# EasyEDA Pro project ProDoc_Board_ESP_AI_2024-12-05.epro, schematic Sche_ESP_AI

## Sheets
1 Power: Board Name: Board_ESP_AI; Create Date: 2024-12-01; Page Name: Power; Project Name: ESP-AI-1.0.2; Schematic Name: Sche_ESP_AI; Update Date: 2024-12-01; Company: 嘉立创EDA; Page Size: A4; Version: V1.0
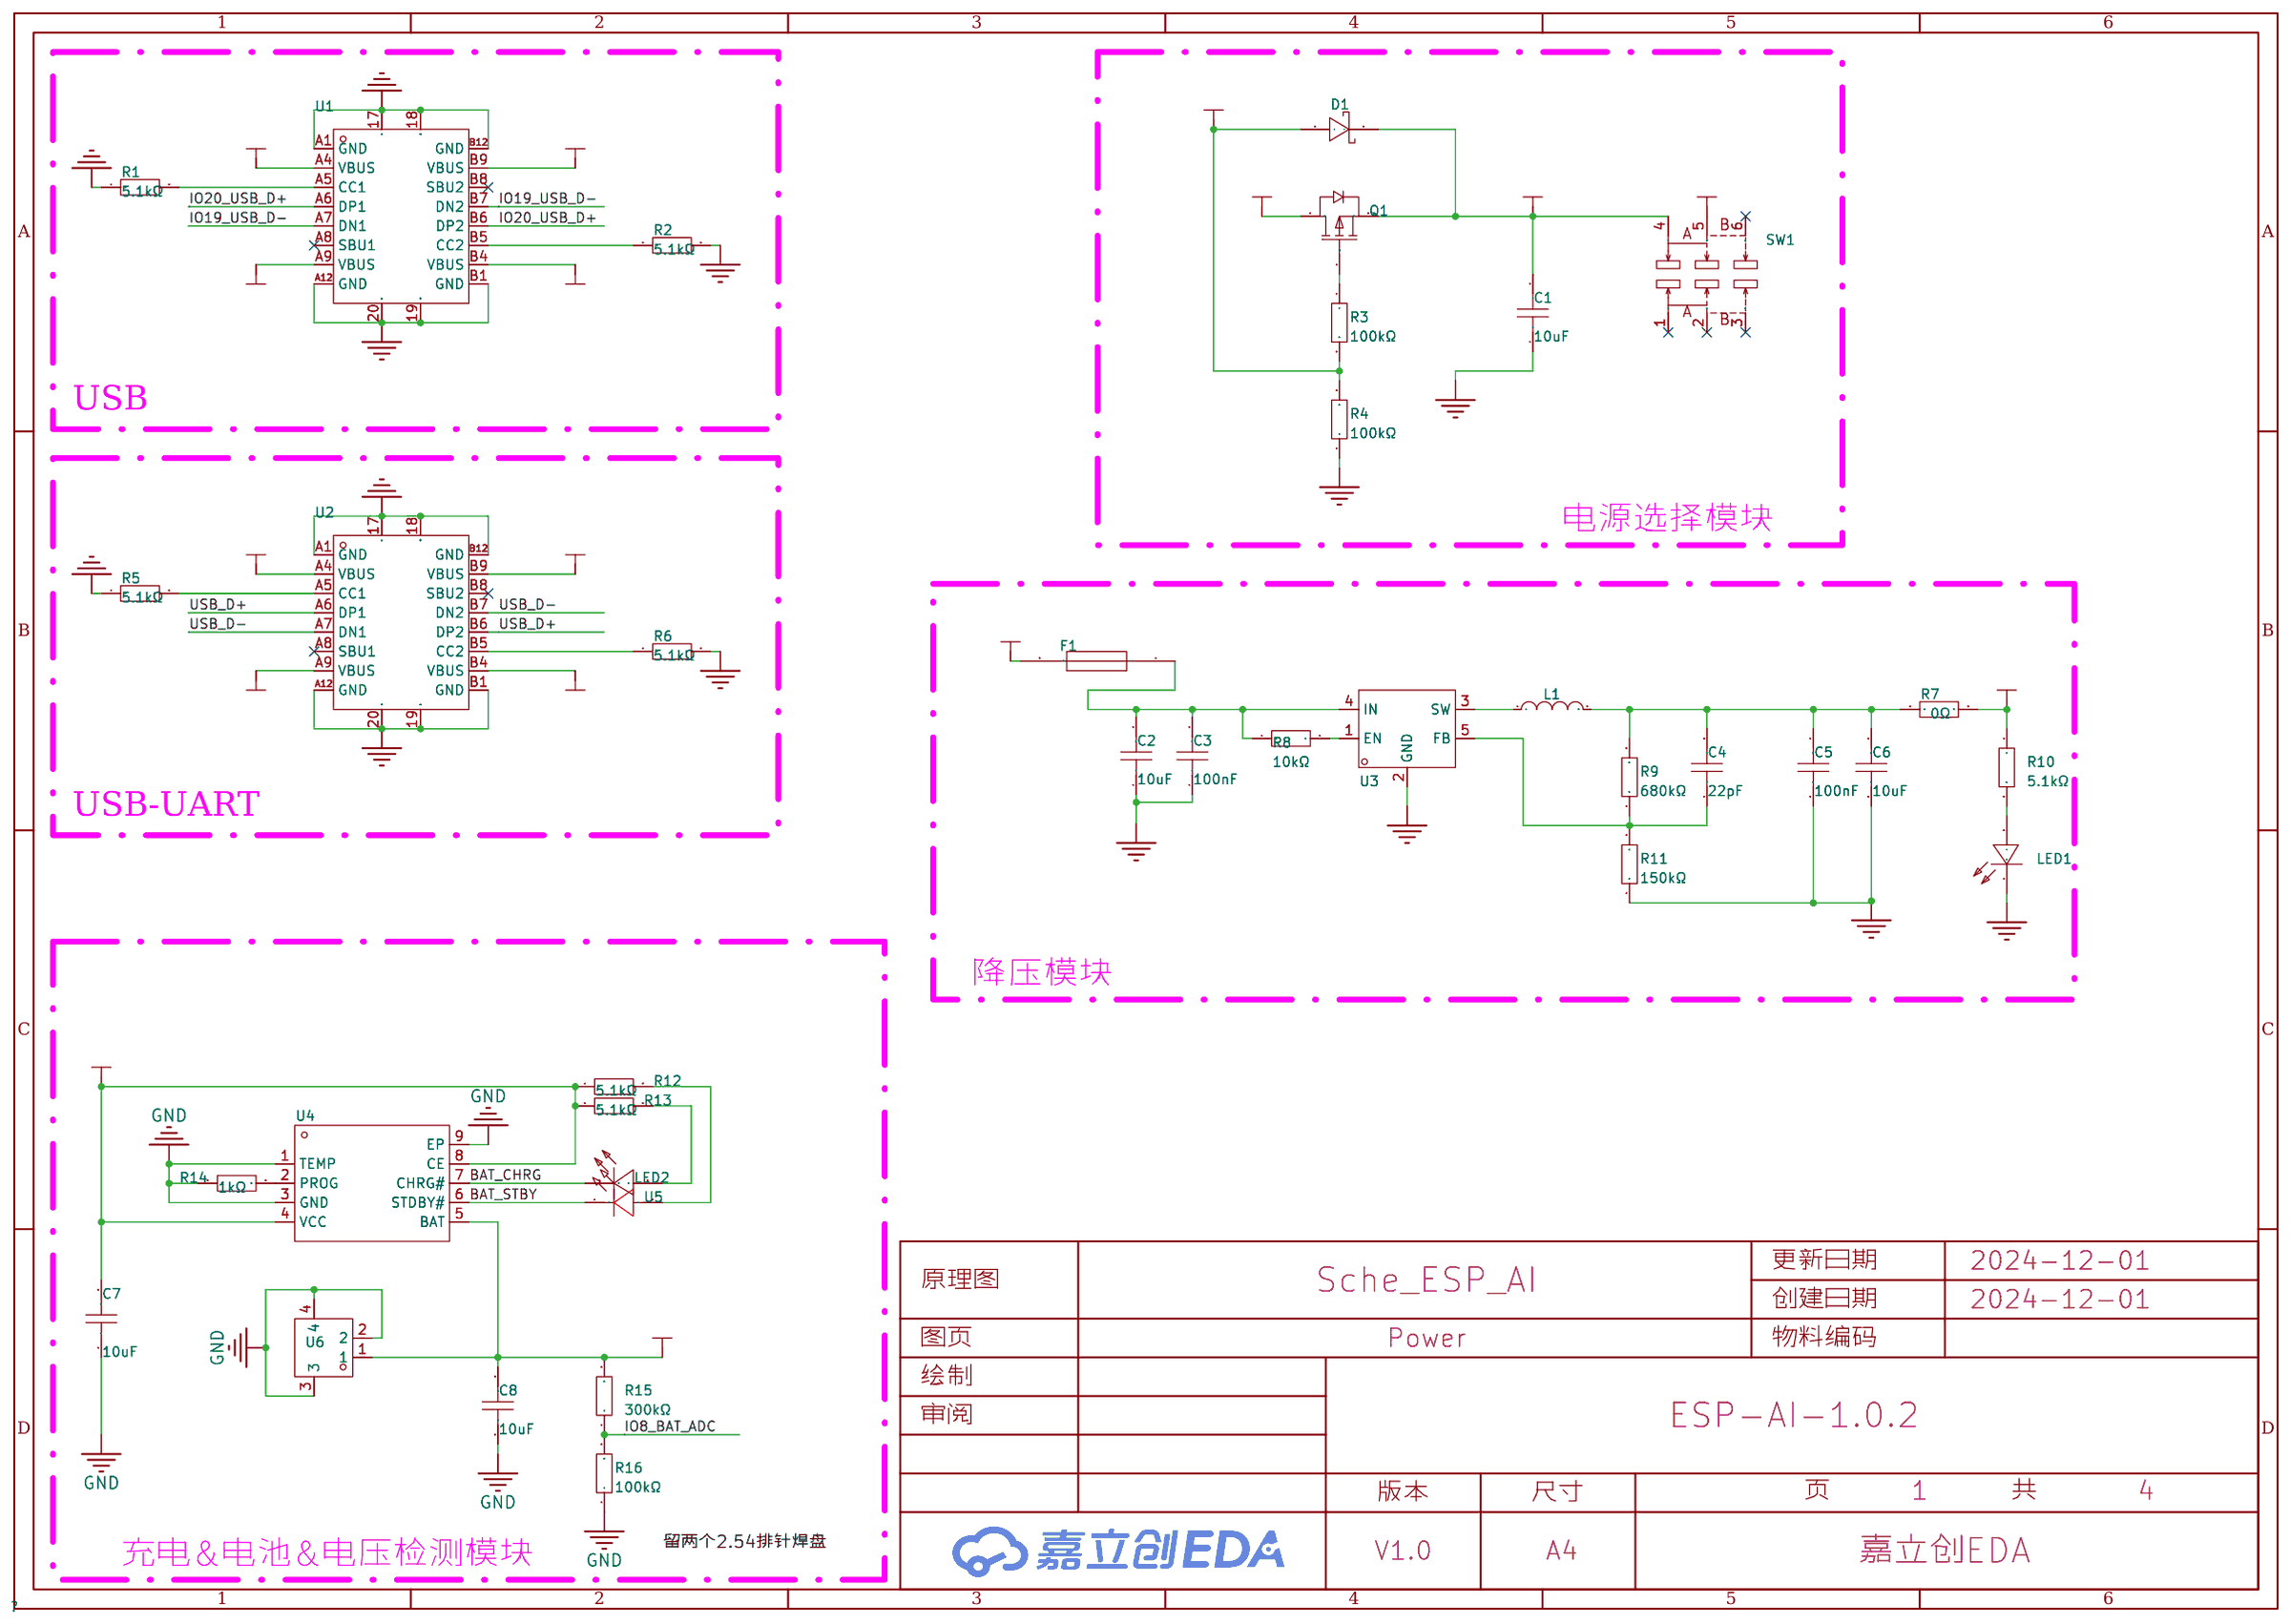
[diagram p0: Power]
2 Mcu: Page Name: Mcu
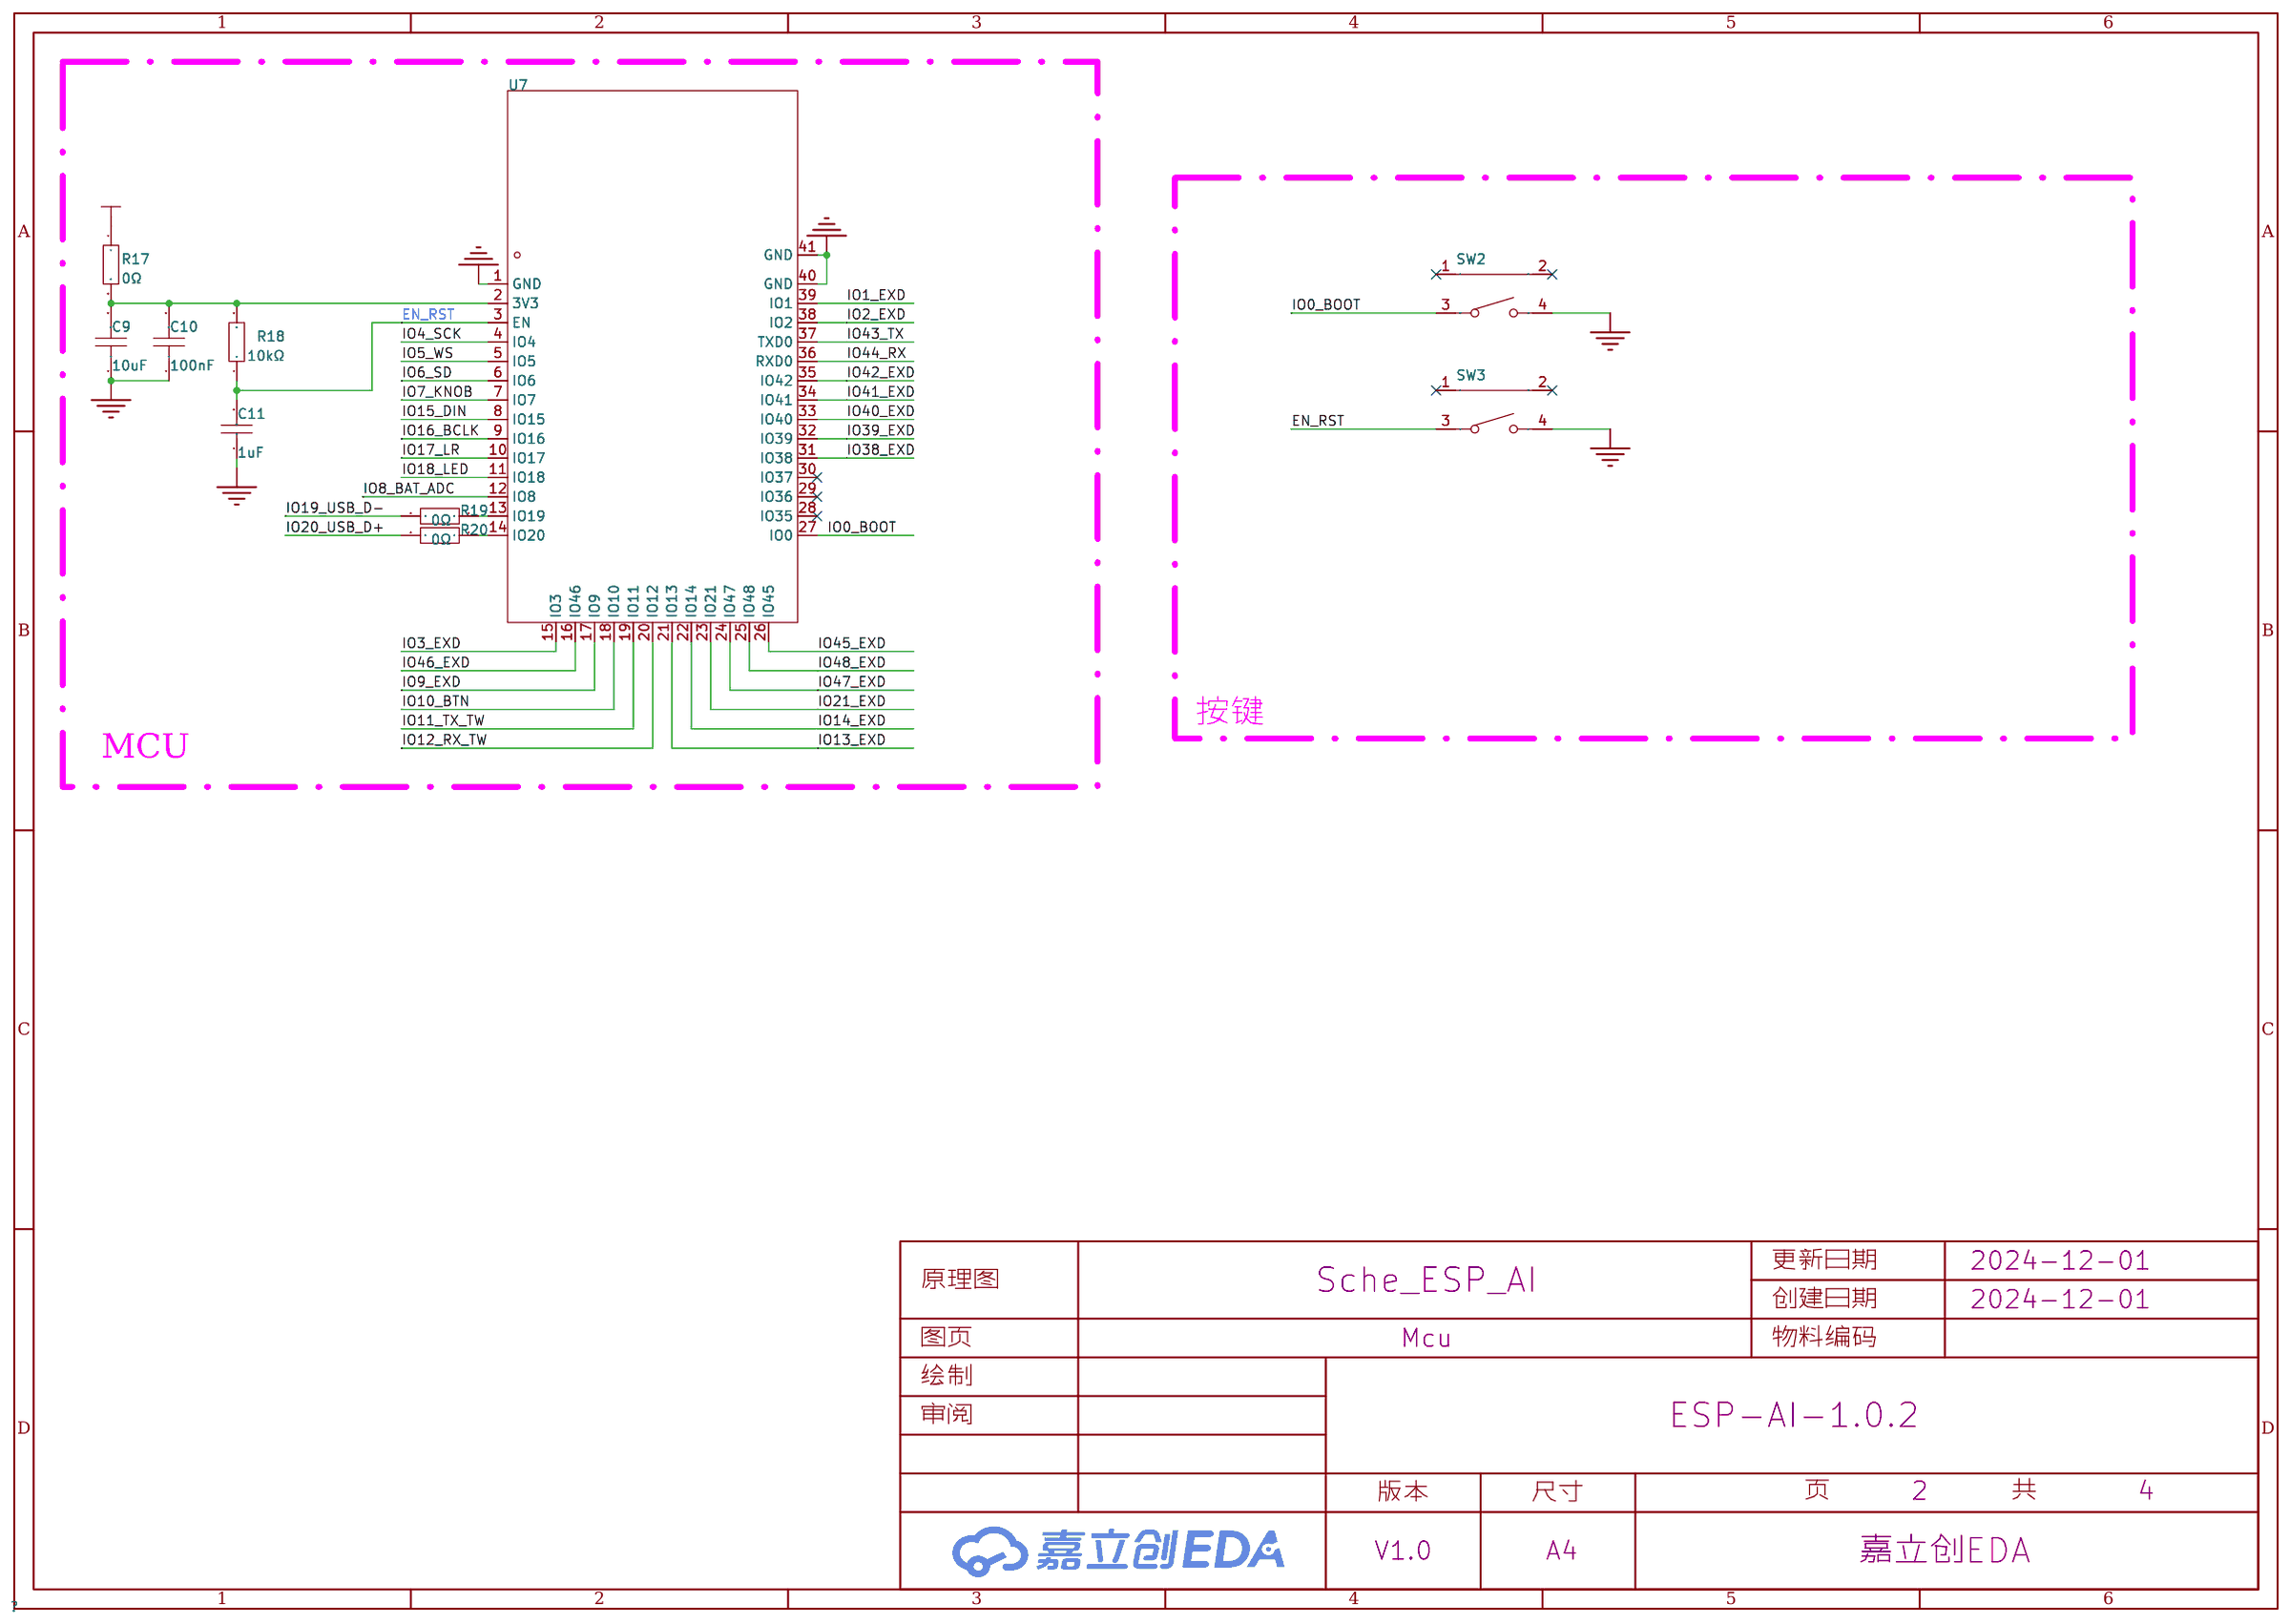
[diagram p1: Mcu]
3 Module: Page Name: Module
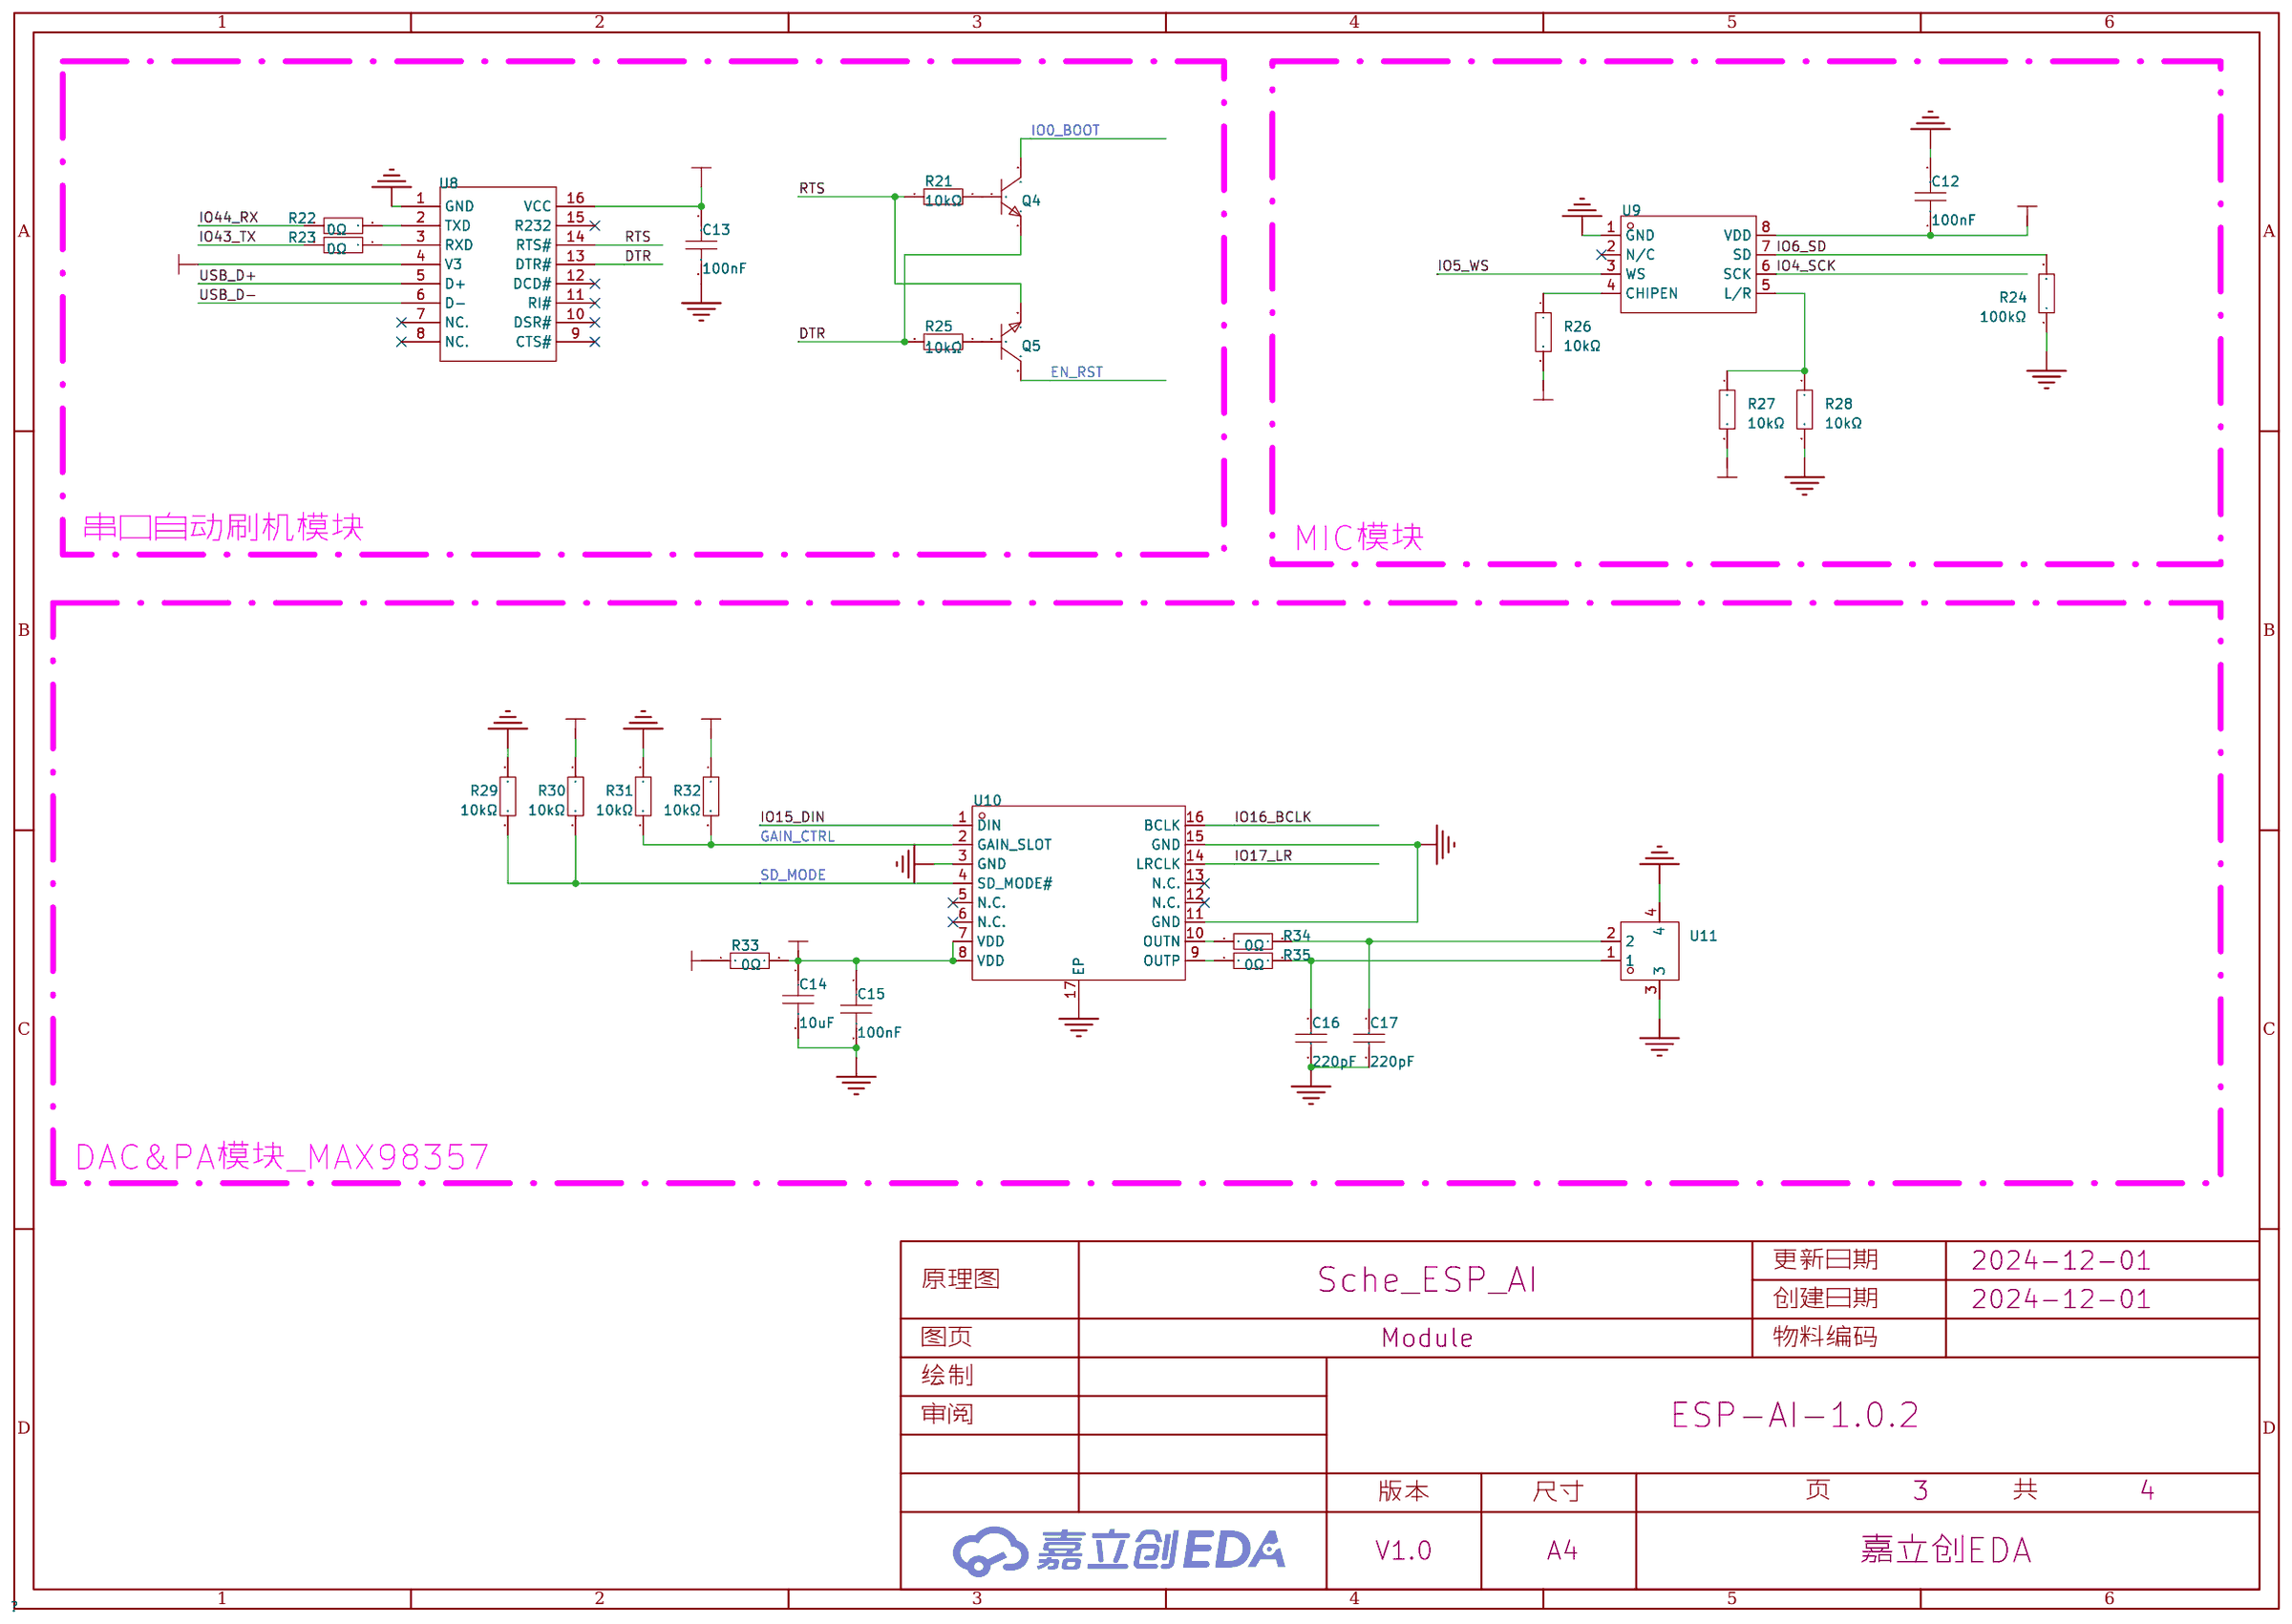
[diagram p2: Module]
4 Interface: Page Name: Interface
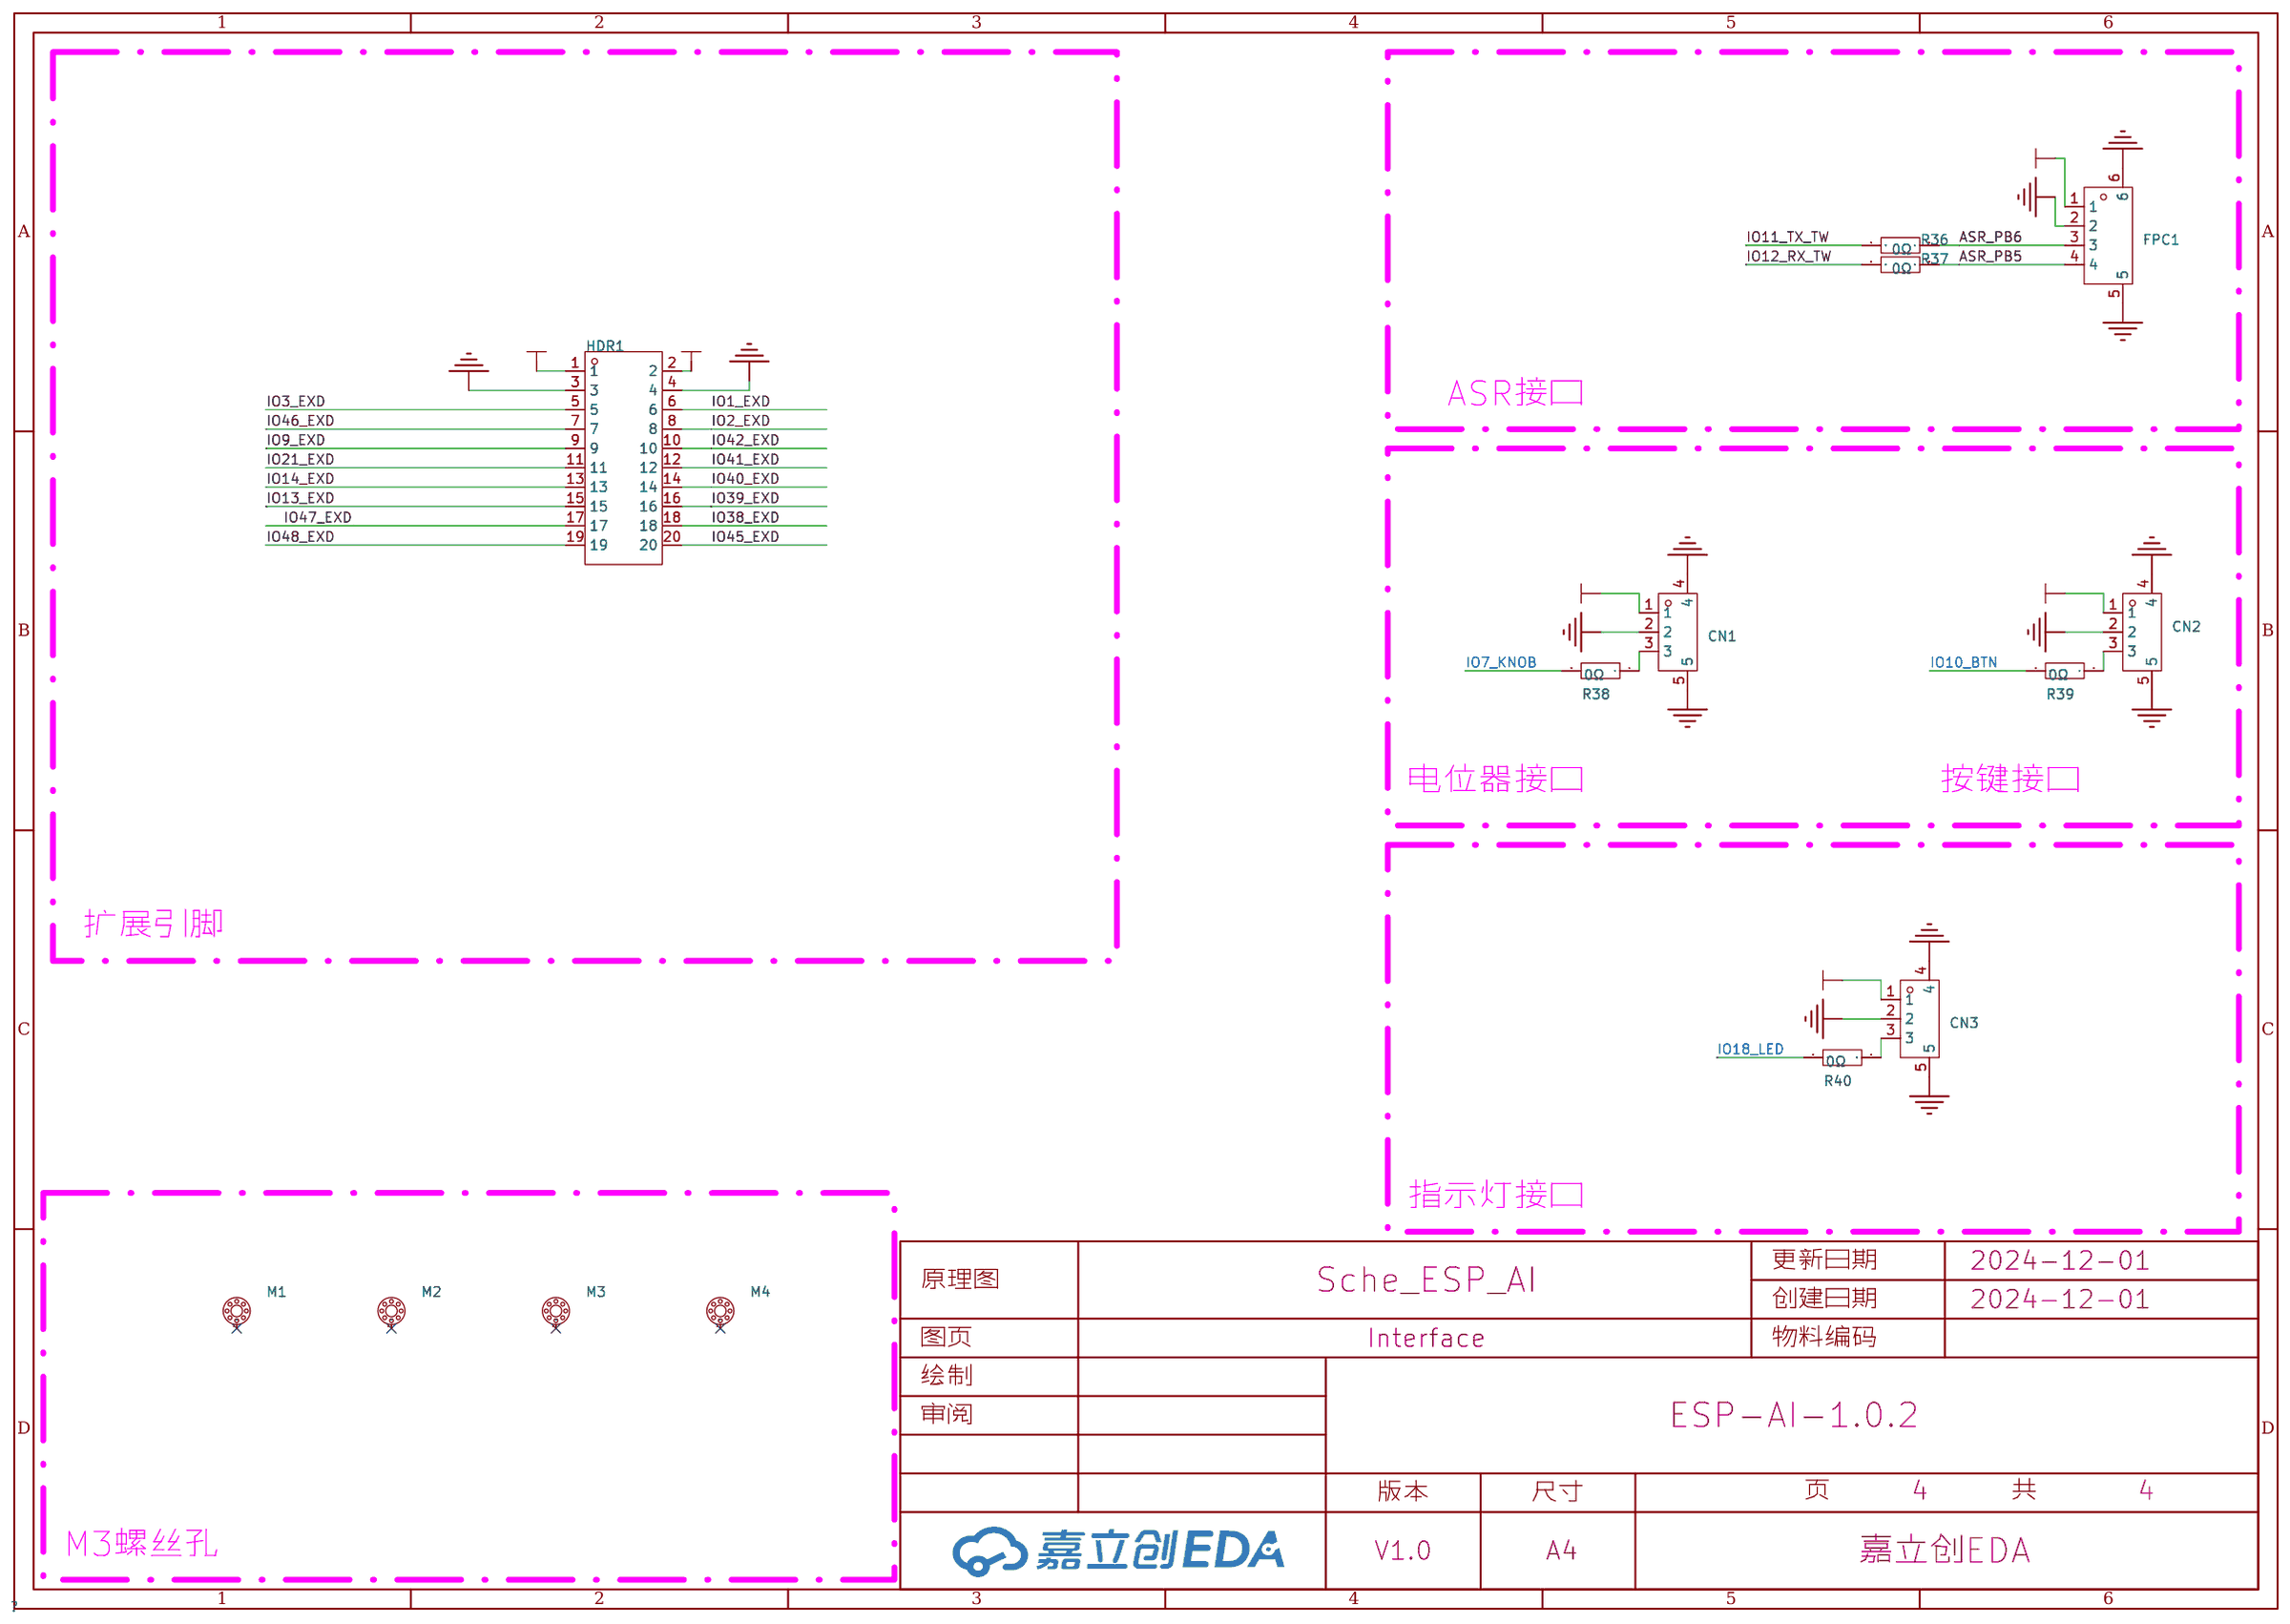
[diagram p3: Interface]

## Parts
sheet Interface
CN1  HC-1.25-3PWT  [CONN-SMD_HC-1.25-3PWT]
CN2  HC-1.25-3PWT  [CONN-SMD_HC-1.25-3PWT]
CN3  HC-1.25-3PWT  [CONN-SMD_HC-1.25-3PWT]
FPC1  1.25-4PWB  [CONN-SMD_1.25-4PWB]
HDR1  PZ254-2-10-S  [HDR-SMD_20P-P2.54-V-M-R2-C10-S7.4]
M1  -  [M3*5安装孔]
M2  -  [M3*5安装孔]
M3  -  [M3*5安装孔]
M4  -  [M3*5安装孔]
R36  0Ω  [R0603_1]
R37  0Ω  [R0603_1]
R38  0Ω  [R0603_1]
R39  0Ω  [R0603_1]
R40  0Ω  [R0603_1]
sheet Mcu
C9  10uF  [C0603]
C10  100nF  [C0603]
C11  1uF  [C0603_1]
R17  0Ω  [R0603_1]
R18  10kΩ  [R0603_1]
R19  0Ω  [R0603_1]
R20  0Ω  [R0603_1]
SW2  TS24CA  [SW-SMD_TS24CA]
SW3  TS24CA  [SW-SMD_TS24CA]
U7  ESP32-S3-WROOM-1-N16R8  [WIRELM-SMD_ESP32-S3-WROOM-1]
sheet Module
C12  100nF  [C0603]
C13  100nF  [C0603_1]
C14  10uF  [C0603]
C15  100nF  [C0603]
C16  220pF  [C0603_1]
C17  220pF  [C0603_1]
Q4  SS8050  [SOT-23-3_L2.9-W1.3-P1.90-LS2.4-BR]
Q5  SS8050  [SOT-23-3_L2.9-W1.3-P1.90-LS2.4-BR]
R21  10kΩ  [R0603_1]
R22  0Ω  [R0603_1]
R23  0Ω  [R0603_1]
R24  100kΩ  [R0603]
R25  10kΩ  [R0603_1]
R26  10kΩ  [R0603_1]
R27  10kΩ  [R0603_1]  (no BOM)
R28  10kΩ  [R0603_1]
R29  10kΩ  [R0603_1]  (no BOM)
R30  10kΩ  [R0603_1]
R31  10kΩ  [R0603_1]
R32  10kΩ  [R0603_1]
R33  0Ω  [R0603_1]
R34  0Ω  [R0603_1]
R35  0Ω  [R0603_1]
U8  CH340C  [SOP-16_L10.0-W3.9-P1.27-LS6.0-BL]
U9  MSM261S4030H0R  [MIC-SMD_8P-L4.0-W3.0-P1.00-BR]
U10  MAX98357AETE+T  [TQFN-16_L3.0-W3.0-P0.50-BL-EP1.5]
U11  HCZZ0015-2  [CONN-SMD_HCZZ0015-2]
sheet Power
C1  10uF  [C0603]
C2  10uF  [C0603]
C3  100nF  [C0603]
C4  22pF  [C0603_1]
C5  100nF  [C0603]
C6  10uF  [C0603]
C7  10uF  [C0603]
C8  10uF  [C0603]
D1  B5819W SL  [SOD-123_L2.7-W1.6-LS3.7-RD-1]
F1  JK-SMD0603-100L  [F0603]
L1  2.2uH  [IND-SMD_L4.0-W4.0]
LED1  KT-0603R  [LED0603-RD]
LED2  KT-0603R  [LED0603-RD]
Q1  AO3401A  [SOT-23_L2.9-W1.3-P1.90-LS2.4-BR]
R1  5.1kΩ  [R0603]
R2  5.1kΩ  [R0603]
R3  100kΩ  [R0603]
R4  100kΩ  [R0603]
R5  5.1kΩ  [R0603]
R6  5.1kΩ  [R0603]
R7  0Ω  [R0603_1]
R8  10kΩ  [R0603_1]
R9  680kΩ  [R0603_1]
R10  5.1kΩ  [R0603]
R11  150kΩ  [R0603_1]
R12  5.1kΩ  [R0603]
R13  5.1kΩ  [R0603]
R14  1kΩ  [R0603]
R15  300kΩ  [R0603]
R16  100kΩ  [R0603]
SW1  MST22D18G2 125  [SW-SMD_MST22D18G2]
U1  24018-UCAF001-A  [TYPE-C-USB-SMD_CF003]
U2  24018-UCAF001-A  [TYPE-C-USB-SMD_CF003]
U3  ETA3409S2F  [SOT-23-5_L2.9-W1.6-P0.95-LS2.8-BL]
U4  AP5056  [SOP-8_L4.9-W3.9-P1.27-LS6.0-BL-EP]
U5  19-217/GHC-YR1S2/6T  [LED0603-RD_GREEN]
U6  HCZZ0015-2  [CONN-SMD_HCZZ0015-2]

## Library data of the parts
CN1-CN3 = HC-1.25-3PWT: 插针结构:1x3P;间距:1.25mm;安装方式:卧贴;参考系列:PicoBlade(MX 1.25);总PIN数:3P;排数:1;每排PIN数:3;行距:-;额定电流:1A;触头材质:黄铜;触头镀层:锡;工作温度范围:-40℃~+105℃;; LCSC Part Name: 1x3P 间距:1.25mm 卧贴 系列:PicoBlade(MX 1.25); Supplier Part: C2845380; Manufacturer: HCTL(华灿天禄); Supplier Footprint: SMD,P=1.25mm,卧贴; JLCPCB Part Class: 扩展库; Datasheet: https://atta.szlcsc.com/upload/public/pdf/source/20240930/9508A8292CCC87B0C29E3A028D56E30A.pdf; Supplier: LCSC; Pins Structure: 1x3P; Pitch: 1.25mm; Mounting Style: 卧贴; Reference Series: PicoBlade(MX 1.25); Number of Pins: 3P; Number of Rows: 1; Number of PINs Per Row: 3; Current Rating (Max): 1A; Contact Material: 黄铜; Contact Plating: 锡; Operating Temperature Range: -40℃~+105℃; Rated Voltage (Max): 125V; Plastic Material: LCP; Flame Retardant Rating: UL94V-0; Supplementary Features: 辅助焊脚; Z-Height of the Board: 3.57mm; X-Length of Bottom Edge on Board (Spacing Line): 8.8mm; Y-Width of Bottom Edge on Board: 5.25mm
FPC1 = 1.25-4PWB: 插针结构:1x4P;间距:1.25mm;安装方式:卧贴;参考系列:-;总PIN数:4P;排数:1;每排PIN数:4;行距:-;额定电流:-;工作温度范围:-40℃~+85℃;; LCSC Part Name: 1x4P 间距:1.25mm 卧贴; Supplier Part: C2905011; Manufacturer: DEALON(德艺隆); Supplier Footprint: SMD,P=1.25mm,卧贴; JLCPCB Part Class: 扩展库; Datasheet: https://atta.szlcsc.com/upload/public/pdf/source/20231123/1AE0876AE9C7DCFC0D68EAC4CBA881B0.pdf; Supplier: LCSC; Pins Structure: 1x4P; Pitch: 1.25mm; Mounting Style: 卧贴; Number of Pins: 4P; Number of Rows: 1; Number of PINs Per Row: 4; Operating Temperature Range: -40℃~+85℃
HDR1 = PZ254-2-10-S: 插针结构:2x10P;间距:2.54mm;行距:2.54mm;圆针/方针:方针;安装类型:立贴;排数:双排;总PIN位数:20P;额定电流:3A;额定电压:250V;配合针长度:6mm;塑高:2.5mm;端接针长度:-;工作温度范围:-40℃~+105℃;焊接温度(最大值):260℃@5S;颜色:黑色;; LCSC Part Name: 2x10P 间距:2.54mm 方针 立贴 黑色; Supplier Part: C3294468; Manufacturer: HCTL(华灿天禄); Supplier Footprint: SMD,P=2.54mm; JLCPCB Part Class: 扩展库; Datasheet: https://atta.szlcsc.com/upload/public/pdf/source/20230609/FB2B5B924AA338E6CB93C3BD1D012B72.pdf; Supplier: LCSC; Pin Structure: 2x10P; Pitch: 2.54mm; Row Spacing: 2.54mm; Circluar Pins/Square Pins: 方针; Mounting Type: 立贴; Number of Rows: 双排; Number of Pins: 20P; Current Rating (Max): 3A; Voltage Rating (Max): 250V; Length of Mating Pin: 6mm; Insulation Height: 2.5mm; Operating Temperature Range: -40℃~+105℃; Soldering Temperature(Max): 260℃@5S; Color: 黑色
M1-M4 = M3螺丝
R17 R19 R20 R22 R23 R33-R40 = 0603WAF0000T5E: 电阻类型:厚膜电阻;阻值:0Ω;精度:±1%;功率:100mW;; LCSC Part Name: 0Ω ±1% 100mW; Supplier Part: C21189; Manufacturer: UNI-ROYAL(厚声); Supplier Footprint: 0603; JLCPCB Part Class: Basic Part; Datasheet: https://atta.szlcsc.com/upload/public/pdf/source/20200306/C422600_1E6D84923E4A46A82E41ADD87F860B5C.pdf; Supplier: LCSC; Type: 厚膜电阻; Tolerance: ±1%; Power(Watts): 100mW; Overload Voltage (Max): 75V; Operating Temperature Range: -55℃~+155℃
C1 C7-C9 = CL10A106KP8NNNC: 容值:10uF;精度:±10%;额定电压:10V;材质(温度系数):X5R;; LCSC Part Name: 10uF ±10% 10V; Supplier Part: C19702; Manufacturer: SAMSUNG(三星); Supplier Footprint: 0603; JLCPCB Part Class: Basic Part; Datasheet: https://atta.szlcsc.com/upload/public/pdf/source/20160103/1457707703378.pdf; Supplier: LCSC; Tolerance: ±10%; Voltage Rated: 10V; Temperature Coefficient: X5R
C10 C13 = CC0603KRX7R9BB104: 容值:100nF;精度:±10%;额定电压:50V;材质(温度系数):X7R;; LCSC Part Name: 100nF ±10% 50V; Supplier Part: C14663; Manufacturer: YAGEO(国巨); Supplier Footprint: 0603; JLCPCB Part Class: Basic Part; Datasheet: https://atta.szlcsc.com/upload/public/pdf/source/20170116/1484561234239.pdf; Supplier: LCSC; Tolerance: ±10%; Voltage Rated: 50V; Temperature Coefficient: X7R
C11 = CL10A105KB8NNNC: 容值:1uF;精度:±10%;额定电压:50V;材质(温度系数):X5R;; LCSC Part Name: 1uF ±10% 50V; Supplier Part: C15849; Manufacturer: SAMSUNG(三星); Supplier Footprint: 0603; JLCPCB Part Class: 基础库; Datasheet: https://atta.szlcsc.com/upload/public/pdf/source/20160103/1457707679084.pdf; Supplier: LCSC; Tolerance: ±10%; Voltage Rated: 50V; Temperature Coefficient: X5R
R18 R26-R32 = 0603WAF1002T5E: 电阻类型:厚膜电阻;阻值:10kΩ;精度:±1%;功率:100mW;; LCSC Part Name: 厚膜电阻 10kΩ ±1% 100mW; Supplier Part: C25804; Manufacturer: UNI-ROYAL(厚声); Supplier Footprint: 0603; JLCPCB Part Class: Basic Part; Datasheet: https://atta.szlcsc.com/upload/public/pdf/source/20200306/C422600_1E6D84923E4A46A82E41ADD87F860B5C.pdf; Supplier: LCSC; Type: 厚膜电阻; Tolerance: ±1%; Power(Watts): 100mW; Temperature Coefficient: ±100ppm/℃; Overload Voltage (Max): 75V; Operating Temperature Range: -55℃~+155℃
SW2 SW3 = TS24CA: 电路结构:单刀单掷;按钮形状:矩形按钮;安装方式:卧贴;开关长度:4.55mm;开关宽度:1.8mm;开关高度:3.5mm;触点电流:50mA;额定电压(DC):12V;带灯:-;机械寿命:-;; LCSC Part Name: 4.55*1.8*3.5mm 卧贴 轻触开关; Supplier Part: C393942; Manufacturer: SHOU HAN(首韩); Supplier Footprint: SMD; JLCPCB Part Class: 扩展库; Datasheet: https://atta.szlcsc.com/upload/public/pdf/source/20190521/C393942_591A9E318887EFA4274D34029981AD99.pdf; Supplier: LCSC; Circuit: 单刀单掷; Actuator Style: 矩形按钮; Mounting Style: 卧贴; Switch Length: 4.55mm; Switch Width: 1.8mm; Switch Height: 3.5mm; Contact Current: 50mA; Voltage Rating (DC): 12V
U7 = ESP32-S3-WROOM-1-N16R8: LCSC Part Name: 通用型Wi-Fi+低功耗蓝牙MCU模组; Supplier Part: C2913202; Manufacturer: ESPRESSIF(乐鑫); Supplier Footprint: SMD,18x25.5mm; JLCPCB Part Class: 扩展库; Datasheet: https://atta.szlcsc.com/upload/public/pdf/source/20220705/4E799F39581577F766659887F738A439.pdf; Supplier: LCSC
C12 C15 = CC0603KRX7R9BB104: 容值:100nF;精度:±10%;额定电压:50V;材质(温度系数):X7R;; LCSC Part Name: 100nF ±10% 50V; Supplier Part: C14663; Manufacturer: YAGEO(国巨); Supplier Footprint: 0603; JLCPCB Part Class: Basic Part; Datasheet: https://atta.szlcsc.com/upload/public/pdf/source/20180910/C282072_33301C7F631E79921B82A8DAC6BCC5B3.pdf; Supplier: LCSC; Tolerance: ±10%; Voltage Rated: 50V; Temperature Coefficient: X7R
C14 = CL10A106KP8NNNC: 容值:10uF;精度:±10%;额定电压:10V;材质(温度系数):X5R;; LCSC Part Name: 10uF ±10% 10V; Supplier Part: C19702; Manufacturer: SAMSUNG(三星); Supplier Footprint: 0603; JLCPCB Part Class: Basic Part; Datasheet: https://atta.szlcsc.com/upload/public/pdf/source/20160103/1457707703378.pdf; Supplier: LCSC; Tolerance: ±10%; Voltage Rated: 10V; Temperature Coefficient: X5R; Check: true
C16 C17 = CL10B221KB8NNNC: 容值:220pF;精度:±10%;额定电压:50V;材质(温度系数):X7R;; LCSC Part Name: 220pF ±10% 50V; Supplier Part: C1603; Manufacturer: SAMSUNG(三星); Supplier Footprint: 0603; JLCPCB Part Class: 基础库; Datasheet: https://atta.szlcsc.com/upload/public/pdf/source/20160218/1457707763339.pdf; Supplier: LCSC; Tolerance: ±10%; Voltage Rated: 50V; Temperature Coefficient: X7R
Q4 Q5 = SS8050_C2150: 晶体管类型:NPN;集电极电流(Ic):1.5A;集射极击穿电压(Vceo):25V;功率(Pd):300mW;直流电流增益(hFE@Ic,Vce):200@100mA,1V;; LCSC Part Name: SS8050(RANGE:200-350) hfe=200~350; Supplier Part: C2150; Manufacturer: CJ(江苏长电/长晶); Supplier Footprint: SOT-23; JLCPCB Part Class: 基础库; Datasheet: https://atta.szlcsc.com/upload/public/pdf/source/20230322/AEE86F4B043774EFF80CAEA14A37D9E9.pdf; Supplier: LCSC; Transistor Type: NPN; Collector Current (Ic): 1.5A; Collector-Emitter Breakdown Voltage (Vceo): 25V; Power Dissipation (Pd): 300mW; DC Current Gain (hFE@Ic,Vce): 200@100mA,1V; Transition Frequency (fT): 100MHz; Collector Cut-Off Current (Icbo): 100nA; Collector-Emitter Saturation Voltage (VCE(sat)@Ic,Ib): 500mV@800mA,80mA
R21 R25 = 0603WAF1002T5E: 电阻类型:厚膜电阻;阻值:10kΩ;精度:±1%;功率:100mW;最大工作电压:75V;温度系数:±100ppm/℃;; LCSC Part Name: 厚膜电阻 10kΩ ±1% 100mW; Supplier Part: C25804; Manufacturer: UNI-ROYAL(厚声); Supplier Footprint: 0603; JLCPCB Part Class: Basic Part; Datasheet: https://atta.szlcsc.com/upload/public/pdf/source/20200306/C422600_1E6D84923E4A46A82E41ADD87F860B5C.pdf; Supplier: LCSC; Type: 厚膜电阻; Tolerance: ±1%; Power(Watts): 100mW; Temperature Coefficient: ±100ppm/℃; Overload Voltage (Max): 75V; Operating Temperature Range: -55℃~+155℃
R3 R4 R16 R24 = 0603WAF1003T5E: 电阻类型:厚膜电阻;阻值:100kΩ;精度:±1%;功率:100mW;最大工作电压:75V;温度系数:±100ppm/℃;; LCSC Part Name: 100kΩ ±1% 100mW 厚膜电阻; Supplier Part: C25803; Manufacturer: UNI-ROYAL(厚声); Supplier Footprint: 0603; JLCPCB Part Class: 基础库; Datasheet: https://atta.szlcsc.com/upload/public/pdf/source/20200306/C422600_1E6D84923E4A46A82E41ADD87F860B5C.pdf; Supplier: LCSC; Type: 厚膜电阻; Tolerance: ±1%; Power(Watts): 100mW; Overload Voltage (Max): 75V; Temperature Coefficient: ±100ppm/℃; Operating Temperature Range: -55℃~+155℃
U8 = CH340C: 类型:Transceiver;协议类别:USB 2.0;驱动器/接收器数:-;数据速率:2Mbps;; Supplier Part: C84681; Manufacturer: WCH(南京沁恒); Supplier Footprint: SOP-16_150mil; JLCPCB Part Class: Extended Part; Datasheet: https://atta.szlcsc.com/upload/public/pdf/source/20200819/C84681_ADBED554CE321879DBD6B1D06488689C.pdf; Supplier: LCSC; Type: Transceiver; Protocol: USB 2.0; Data Rate: 2Mbps; Supply Voltage: 3.3V, 5V
U9 = MSM261S4030H0R: Supplier Part: C2840615; Manufacturer: MEMS(敏芯微); JLCPCB Part Class: Extended Part; Datasheet: https://atta.szlcsc.com/upload/public/pdf/source/20210707/C2840615_6AE5BCBEE3224C96A8195D5DC270E7C8.pdf; Supplier: LCSC
U10 = MAX98357AETE+T: 功放类型:-;扬声器通道数:单声道;输出功率:3.2Wx2@4Ω;; Supplier Part: C910544; Manufacturer: ADI(亚德诺)/MAXIM(美信); Supplier Footprint: TQFN-16-EP(3x3); JLCPCB Part Class: 扩展库; Datasheet: https://atta.szlcsc.com/upload/public/pdf/source/20210106/C910544_CB6DE4B2CEE254A72E6BDB40E718D281.pdf; Supplier: LCSC; Speaker Channels: 单声道; Output Power: 3.2Wx2@4Ω; Supply Voltage: 2.5V~5.5V; Operating Temperature: -40℃~+85℃
U6 U11 = HCZZ0015-2: 插针结构:1x2P;间距:1.25mm;安装方式:立贴;参考系列:-;总PIN数:2P;排数:1;每排PIN数:2;额定电流:1A;触头材质:黄铜;触头镀层:锡;工作温度范围:-25℃~+85℃;; LCSC Part Name: 1x2P 间距:1.25mm 立贴 米色; Supplier Part: C7433468; Manufacturer: HC(虹成电子); Supplier Footprint: SMD,P=1.25mm; JLCPCB Part Class: 扩展库; Datasheet: https://atta.szlcsc.com/upload/public/pdf/source/20230626/6644A2A467501A815C84848BA54D6777.pdf; Supplier: LCSC; Pins Structure: 1x2P; Pitch: 1.25mm; Mounting Style: 立贴; Number of Pins: 2P; Number of Rows: 1; Number of PINs Per Row: 2; Current Rating (Max): 1A; Contact Material: 黄铜; Contact Plating: 锡; Operating Temperature Range: -25℃~+85℃
C2 C6 = CL10A106KP8NNNC: 容值:10uF;精度:±10%;额定电压:10V;材质(温度系数):X5R;; LCSC Part Name: 10uF ±10% 10V; Supplier Part: C19702; Manufacturer: SAMSUNG(三星); Supplier Footprint: 0603; JLCPCB Part Class: Basic Part; Datasheet: https://atta.szlcsc.com/upload/public/pdf/source/20160218/1457707763339.pdf; Supplier: LCSC; Tolerance: ±10%; Voltage Rated: 10V; Temperature Coefficient: X5R; Check: true
C3 C5 = CC0603KRX7R9BB104: 容值:100nF;精度:±10%;额定电压:50V;材质(温度系数):X7R;; LCSC Part Name: 100nF ±10% 50V; Supplier Part: C14663; Manufacturer: YAGEO(国巨); Supplier Footprint: 0603; JLCPCB Part Class: Basic Part; Datasheet: https://atta.szlcsc.com/upload/public/pdf/source/20180910/C282072_33301C7F631E79921B82A8DAC6BCC5B3.pdf; Supplier: LCSC; Tolerance: ±10%; Voltage Rated: 50V; Temperature Coefficient: X7R; Check: true
C4 = CL10C220JB8NNNC: 容值:22pF;精度:±5%;额定电压:50V;材质(温度系数):C0G;; LCSC Part Name: 22pF ±5% 50V; Supplier Part: C1653; Manufacturer: SAMSUNG(三星); Supplier Footprint: 0603; JLCPCB Part Class: Basic Part; Datasheet: https://atta.szlcsc.com/upload/public/pdf/source/20160218/1457707763339.pdf; Supplier: LCSC; Tolerance: ±5%; Voltage Rated: 50V; Temperature Coefficient: C0G; Check: true
D1 = B5819W SL: 正向压降(Vf):600mV@1A;直流反向耐压(Vr):40V;整流电流:1A;; LCSC Part Name: 电压:40V 电流:1A; Supplier Part: C8598; Manufacturer: CJ(江苏长电/长晶); Supplier Footprint: SOD-123; JLCPCB Part Class: 基础库; Datasheet: https://atta.szlcsc.com/upload/public/pdf/source/20171228/C164911_15144413243851213914.pdf; Supplier: LCSC; Forward Voltage (Vf@If): 600mV@1A; Reverse Voltage (Vr): 40V; Rectified Current: 1A
F1 = JK-SMD0603-100L: 最大电压:6V;最大电流:50A;保持电流:1A;跳闸电流:2A;; LCSC Part Name: 6V 1A 0603自恢复; Supplier Part: C516069; Manufacturer: JK(金科); Supplier Footprint: 0603; JLCPCB Part Class: 扩展库; Datasheet: https://atta.szlcsc.com/upload/public/pdf/source/20200708/C516069_8ECE3CE483DABC16F21EEE01B7E83616.pdf; Supplier: LCSC; Operating Voltage (Max): 6V; Current Rating (Max): 50A; Hold Current: 1A; Trip Current: 2A; Power Dissipation: 500mW; Resistance - Initial (Ri) (Min): 45mΩ; Resistance - Post Trip (R1) (Max): 120mΩ; Maximum Time to Trip: 2s; Operating Temperature: -40℃~+85℃
L1 = SPH4018H2R2MT: 电感值:2.2uH;精度:±20%;额定电流:2.2A;饱和电流(Isat):3A;类型:-;; LCSC Part Name: 2.2uH ±20% 3A; Supplier Part: C370436; Manufacturer: Sunlord(顺络); Supplier Footprint: SMD,4x4x1.8mm; JLCPCB Part Class: Extended Part; Datasheet: https://atta.szlcsc.com/upload/public/pdf/source/20231024/91C3B1E68892D3DB9D2F9A4F7057A096.pdf; Supplier: LCSC; Tolerance: ±20%; Rated Current: 2.2A; Saturation Current (Isat): 3A; DC Resistance (DCR): 42mΩ; Check: true
LED1 LED2 = KT-0603R: 发光颜色:红色;功率:-;正向电流:-;主波长:-;二极管配置:-;透镜颜色:-;色温:-;发光角度:-;载带方式:-;工作温度:-40℃~+85℃;; LCSC Part Name: 0603 红灯 高亮; Supplier Part: C2286; Manufacturer: KENTO; Supplier Footprint: 0603; JLCPCB Part Class: 基础库; Datasheet: https://atta.szlcsc.com/upload/public/pdf/source/20160616/1466072038404.pdf; Supplier: LCSC; Emitted Color: 红色; Operating Temperature: -40℃~+85℃
Q1 = AO3401A_C15127: 类型:1个P沟道;漏源电压(Vdss):30V;连续漏极电流(Id):4A;功率(Pd):1.4W;导通电阻(RDS(on)@Vgs,Id):44mΩ@10V,4.3A;阈值电压(Vgs(th)@Id):1.3V@250uA;; LCSC Part Name: 1个P沟道 耐压:30V 电流:4A; Supplier Part: C15127; Manufacturer: AOS; Supplier Footprint: SOT-23; JLCPCB Part Class: 基础库; Datasheet: https://atta.szlcsc.com/upload/public/pdf/source/20160507/1462613609053.pdf; Supplier: LCSC; Type: 1个P沟道; Drain Source Voltage (Vdss): 30V; Continuous Drain Current (Id): 4A; Power Dissipation (Pd): 1.4W; Drain Source On Resistance (RDS(on)@Vgs,Id): 44mΩ@10V,4.3A; Gate Threshold Voltage (Vgs(th)@Id): 1.3V@250uA; Total Gate Charge (Qg@Vgs): 12.2nC@4.5V; Input Capacitance (Ciss@Vds): 1.2nF@15V; Operating Temperature: -55℃~+150℃@(Tj)
R1 R2 R5 R6 R10 R12 R13 = 0603WAF5101T5E: 电阻类型:厚膜电阻;阻值:5.1kΩ;精度:±1%;功率:100mW;最大工作电压:75V;温度系数:±100ppm/℃;; LCSC Part Name: 5.1kΩ ±1% 100mW 厚膜电阻; Supplier Part: C23186; Manufacturer: UNI-ROYAL(厚声); Supplier Footprint: 0603; JLCPCB Part Class: 基础库; Datasheet: https://atta.szlcsc.com/upload/public/pdf/source/20200306/C422600_1E6D84923E4A46A82E41ADD87F860B5C.pdf; Supplier: LCSC; Type: 厚膜电阻; Tolerance: ±1%; Power(Watts): 100mW; Overload Voltage (Max): 75V; Temperature Coefficient: ±100ppm/℃; Operating Temperature Range: -55℃~+155℃
R7 = 0603WAF0000T5E: 电阻类型:厚膜电阻;阻值:0Ω;精度:±1%;功率:100mW;最大工作电压:75V;; LCSC Part Name: 0Ω ±1% 100mW 厚膜电阻; Supplier Part: C21189; Manufacturer: UNI-ROYAL(厚声); Supplier Footprint: 0603; JLCPCB Part Class: Basic Part; Datasheet: https://atta.szlcsc.com/upload/public/pdf/source/20200306/C422600_1E6D84923E4A46A82E41ADD87F860B5C.pdf; Supplier: LCSC; Type: 厚膜电阻; Tolerance: ±1%; Power(Watts): 100mW; Overload Voltage (Max): 75V; Operating Temperature Range: -55℃~+155℃; Check: true
R8 = 0603WAF1002T5E: 电阻类型:厚膜电阻;阻值:10kΩ;精度:±1%;功率:100mW;最大工作电压:75V;温度系数:±100ppm/℃;; LCSC Part Name: 厚膜电阻 10kΩ ±1% 100mW; Supplier Part: C25804; Manufacturer: UNI-ROYAL(厚声); Supplier Footprint: 0603; JLCPCB Part Class: Basic Part; Datasheet: https://atta.szlcsc.com/upload/public/pdf/source/20200306/C422600_1E6D84923E4A46A82E41ADD87F860B5C.pdf; Supplier: LCSC; Type: 厚膜电阻; Tolerance: ±1%; Power(Watts): 100mW; Temperature Coefficient: ±100ppm/℃; Overload Voltage (Max): 75V; Operating Temperature Range: -55℃~+155℃; Check: true
R9 = 0603WAF6803T5E: 电阻类型:厚膜电阻;阻值:680kΩ;精度:±1%;功率:100mW;最大工作电压:75V;温度系数:±100ppm/℃;; LCSC Part Name: 680kΩ ±1% 100mW 厚膜电阻; Supplier Part: C25822; Manufacturer: UNI-ROYAL(厚声); Supplier Footprint: 0603; JLCPCB Part Class: Extended Part; Datasheet: https://atta.szlcsc.com/upload/public/pdf/source/20200306/C422600_1E6D84923E4A46A82E41ADD87F860B5C.pdf; Supplier: LCSC; Tolerance: ±1%; Power(Watts): 100mW; Overload Voltage (Max): 75V; Temperature Coefficient: ±100ppm/℃; Type: 厚膜电阻; Operating Temperature Range: -55℃~+155℃; Check: true
R11 = 0603WAF1503T5E: 电阻类型:厚膜电阻;阻值:150kΩ;精度:±1%;功率:100mW;最大工作电压:75V;温度系数:±100ppm/℃;; LCSC Part Name: 150kΩ ±1% 100mW 厚膜电阻; Supplier Part: C22807; Manufacturer: UNI-ROYAL(厚声); Supplier Footprint: 0603; JLCPCB Part Class: Basic Part; Datasheet: https://atta.szlcsc.com/upload/public/pdf/source/20200306/C422600_1E6D84923E4A46A82E41ADD87F860B5C.pdf; Supplier: LCSC; Type: 厚膜电阻; Tolerance: ±1%; Power(Watts): 100mW; Temperature Coefficient: ±100ppm/℃; Overload Voltage (Max): 75V; Operating Temperature Range: -55℃~+155℃; Check: true
R14 = 0603WAF1001T5E: 电阻类型:厚膜电阻;阻值:1kΩ;精度:±1%;功率:100mW;最大工作电压:75V;温度系数:±100ppm/℃;; LCSC Part Name: 1kΩ ±1% 100mW 厚膜电阻; Supplier Part: C21190; Manufacturer: UNI-ROYAL(厚声); Supplier Footprint: 0603; JLCPCB Part Class: 基础库; Datasheet: https://atta.szlcsc.com/upload/public/pdf/source/20200306/C422600_1E6D84923E4A46A82E41ADD87F860B5C.pdf; Supplier: LCSC; Type: 厚膜电阻; Tolerance: ±1%; Power(Watts): 100mW; Overload Voltage (Max): 75V; Temperature Coefficient: ±100ppm/℃; Operating Temperature Range: -55℃~+155℃
R15 = 0603WAF3003T5E: 电阻类型:厚膜电阻;阻值:300kΩ;精度:±1%;功率:100mW;最大工作电压:75V;温度系数:±100ppm/℃;; LCSC Part Name: 300kΩ ±1% 100mW 厚膜电阻; Supplier Part: C23024; Manufacturer: UNI-ROYAL(厚声); Supplier Footprint: 0603; JLCPCB Part Class: 基础库; Datasheet: https://atta.szlcsc.com/upload/public/pdf/source/20200306/C422600_1E6D84923E4A46A82E41ADD87F860B5C.pdf; Supplier: LCSC; Type: 厚膜电阻; Tolerance: ±1%; Power(Watts): 100mW; Overload Voltage (Max): 75V; Temperature Coefficient: ±100ppm/℃; Operating Temperature Range: -55℃~+155℃
SW1 = MST22D18G2 125: 电路结构:双刀双掷;安装方式:立贴;开关颜色:黑色;额定电流(DC):100mA;额定电压(DC):12V;机械寿命:1万次;; LCSC Part Name: 拨动开关/两档立式 6脚贴片 柄长2.0mm 大六立贴 9.1*3.5mm; Supplier Part: C2906280; Manufacturer: SHOU HAN(首韩); Supplier Footprint: SMD; JLCPCB Part Class: 扩展库; Datasheet: https://atta.szlcsc.com/upload/public/pdf/source/20211019/449AD4EDF23AADA7A5C4E3C063EDBB30.pdf; Supplier: LCSC; Circuit: 双刀双掷; Pin Style: 鸥翼型; Mounting Style: 立贴; Actuator Color: 黑色; Current Rating (DC): 100mA; Voltage Rating (DC): 12V; Mechanical Life: 1万次; Operating Temperature: -25℃~+70℃
U1 U2 = 24018-UCAF001-A: TYPE C 16P母座加高1.0 H=4.25无弹; LCSC Part Name: TYPE C; Supplier Part: C3148202; Manufacturer: MINTRON(明硕); Supplier Footprint: SMD; JLCPCB Part Class: Extended Part; Datasheet: https://atta.szlcsc.com/upload/public/pdf/source/20220705/E5F2CA3AC83E324DB8CC8FCBE4CC7AA7.pdf; Supplier: LCSC
U3 = ETA3409S2F: Supplier: LCSC; Supplier Part: C7465553; Manufacturer: ETA(钰泰）; link: https://atta.szlcsc.com/upload/public/pdf/source/20230717/1A18EB96698AD4DC30E5926DF3CDB8A4.pdf; Supplier Footprint: SOT23-5; JLCPCB Part Class: 扩展库; Datasheet: https://atta.szlcsc.com/upload/public/pdf/source/20230717/1A18EB96698AD4DC30E5926DF3CDB8A4.pdf
U4 = AP5056: 常用锂电池充电芯片，功能同TP4056; Supplier Part: C81910; Manufacturer: chipown(芯朋微电子); Supplier Footprint: SOP-8-EP; JLCPCB Part Class: Extended Part; Datasheet: https://atta.szlcsc.com/upload/public/pdf/source/20170918/C81910_1505700200349975039.pdf; Supplier: LCSC
U5 = 19-217/GHC-YR1S2/6T: LCSC Part Name: 翠绿; Supplier Part: C2986059; Manufacturer: EVERLIGHT(亿光); Supplier Footprint: 0603; JLCPCB Part Class: 扩展库; Datasheet: https://atta.szlcsc.com/upload/public/pdf/source/20220705/5270194960AA522E2931401D212035CB.pdf; Supplier: LCSC

## Nets
GND: C1.1 C2.1 C3.1 C5.2 C6.2 C7.1 C8.1 C9.1 C10.1 C11.1 C12.2 C13.2 C14.2 C15.2 C16.1 C17.1 CN1.2 CN1.4 CN1.5 CN2.2 CN2.4 CN2.5 CN3.2 CN3.4 CN3.5 FPC1.2 FPC1.5 FPC1.6 HDR1.3 HDR1.4 LED1.1(K) R1.1 R2.2 R4.1 R5.1 R6.2 R11.1 R14.1 R16.1 R24.1 R28.2 R29.1 R31.1 SW2.4 SW3.4 U1.17 U1.18 U1.19 U1.20 U1.A1(GND) U1.A12(GND) U1.B1(GND) U1.B12(GND) U2.17 U2.18 U2.19 U2.20 U2.A1(GND) U2.A12(GND) U2.B1(GND) U2.B12(GND) U3.2(GND) U4.1(TEMP) U4.3(GND) U4.9(EP) U6.2 U6.3 U6.4 U7.1(GND) U7.40(GND) U7.41(GND) U8.1(GND) U9.1(GND) U10.3(GND) U10.11(GND) U10.15(GND) U10.17(EP) U11.3 U11.4
VBAT: C8.2 Q1.3(D) R15.2 U4.5(BAT) U6.1
VCC_3V3: C12.1 C13.1 CN1.1 CN2.1 CN3.1 FPC1.1 HDR1.2 R7.2 R10.1 R17.1 R26.2 R27.2 R33.1 U8.4(V3) U8.16(VCC) U9.8(VDD)
VCC_BOARD: F1.2 SW1.5
ASR_PB5: FPC1.4 R37.1
ASR_PB6: FPC1.3 R36.1
AUX_VCC: C1.2 D1.1(-) Q1.2(S) SW1.4
BAT_CHRG: LED2.1(K) U4.7(CHRG#)
BAT_STBY: U4.6(STDBY#) U5.1(K)
DTR: Q4.2(E) R25.2 U8.13(DTR#)
EN_RST: C11.2 Q5.3(C) R18.1 SW3.3 U7.3(EN)
GAIN_CTRL: R31.2 R32.2 U10.2(GAIN_SLOT)
IO0_BOOT: Q4.3(C) SW2.3 U7.27(IO0)
IO1_EXD: HDR1.6 U7.39(IO1)
IO2_EXD: HDR1.8 U7.38(IO2)
IO3_EXD: HDR1.5 U7.15(IO3)
IO4_SCK: U7.4(IO4) U9.6(SCK)
IO5_WS: U7.5(IO5) U9.3(WS)
IO6_SD: R24.2 U7.6(IO6) U9.7(SD)
IO7_KNOB: R38.2 U7.7(IO7)
IO8_BAT_ADC: R15.1 R16.2 U7.12(IO8)
IO9_EXD: HDR1.9 U7.17(IO9)
IO10_BTN: R39.2 U7.18(IO10)
IO11_TX_TW: R36.2 U7.19(IO11)
IO12_RX_TW: R37.2 U7.20(IO12)
IO13_EXD: HDR1.15 U7.21(IO13)
IO14_EXD: HDR1.13 U7.22(IO14)
IO15_DIN: U7.8(IO15) U10.1(DIN)
IO16_BCLK: U7.9(IO16) U10.16(BCLK)
IO17_LR: U7.10(IO17) U10.14(LRCLK)
IO18_LED: R40.2 U7.11(IO18)
IO19_USB_D-: R19.2 U1.A7(DN1) U1.B7(DN2)
IO20_USB_D+: R20.2 U1.A6(DP1) U1.B6(DP2)
IO21_EXD: HDR1.11 U7.23(IO21)
IO38_EXD: HDR1.18 U7.31(IO38)
IO39_EXD: HDR1.16 U7.32(IO39)
IO40_EXD: HDR1.14 U7.33(IO40)
IO41_EXD: HDR1.12 U7.34(IO41)
IO42_EXD: HDR1.10 U7.35(IO42)
IO43_TX: R23.2 U7.37(TXD0)
IO44_RX: R22.2 U7.36(RXD0)
IO45_EXD: HDR1.20 U7.26(IO45)
IO46_EXD: HDR1.7 U7.16(IO46)
IO47_EXD: HDR1.17 U7.24(IO47)
IO48_EXD: HDR1.19 U7.25(IO48)
MAX_3V3: C14.1 C15.1 R30.1 R32.1 R33.2 U10.7(VDD) U10.8(VDD)
RTS: Q5.2(E) R21.2 U8.14(RTS#)
SD_MODE: R29.2 R30.2 U10.4(SD_MODE#)
USB_5V: C7.2 D1.2(+) HDR1.1 R3.2 R4.2 R12.1 R13.1 U1.A4(VBUS) U1.A9(VBUS) U1.B4(VBUS) U1.B9(VBUS) U2.A4(VBUS) U2.A9(VBUS) U2.B4(VBUS) U2.B9(VBUS) U4.4(VCC) U4.8(CE)
USB_D+: U2.A6(DP1) U2.B6(DP2) U8.5(D+)
USB_D-: U2.A7(DN1) U2.B7(DN2) U8.6(D-)
$1N4709: R1.2 U1.A5(CC1)
$1N4722: R2.1 U1.B5(CC2)
$1N5072: Q1.1(G) R3.1
$1N5555: LED1.2(A) R10.2
$1N6052: C4.2 C5.1 C6.1 L1.2 R7.1 R9.2
$1N6054: L1.1 U3.3(SW)
$1N6055: C4.1 R9.1 R11.2 U3.5(FB)
$1N6057: C2.2 C3.2 F1.1 R8.1 U3.4(IN)
$1N6058: R8.2 U3.1(EN)
$1N8206: R12.2 U5.2(A)
$1N8207: LED2.2(A) R13.2
$1N8211: R14.2 U4.2(PROG)
$1N11656: R6.1 U2.B5(CC2)
$1N11663: R5.2 U2.A5(CC1)
$2N631: C9.2 C10.2 R17.2 R18.2 U7.2(3V3)
$2N764: R20.1 U7.14(IO20)
$2N769: R19.1 U7.13(IO19)
$3N640: R22.1 U8.2(TXD)
$3N641: R23.1 U8.3(RXD)
$3N2290: R34.1 U10.10(OUTN)
$3N2291: R35.1 U10.9(OUTP)
$3N2292: C17.2 R34.2 U11.2
$3N2293: C16.2 R35.2 U11.1
$3N9618: R26.1 U9.4(CHIPEN)
$3N9620: R27.1 R28.1 U9.5(L/R)
$3N12428: Q4.1(B) R21.1
$3N12472: Q5.1(B) R25.1
$4N844: CN3.3 R40.1
$4N967: CN1.3 R38.1
$4N1500: CN2.3 R39.1

Not connected (* = marked no-connect by the designer): M1 1*; M2 1*; M3 1*; M4 1*; SW1 1* 2* 3* 6*; SW2 1* 2*; SW3 1* 2*; U1 A8(SBU1)* B8(SBU2)*; U2 A8(SBU1)* B8(SBU2)*; U7 28(IO35)* 29(IO36)* 30(IO37)*; U8 7(NC.)* 8(NC.)* 9(CTS#)* 10(DSR#)* 11(RI#)* 12(DCD#)* 15(R232)*; U9 2(N/C)*; U10 5(N.C.)* 6(N.C.)* 12(N.C.)* 13(N.C.)*

## Notes on the sheets
sheet 1
- USB
- 电源选择模块
- USB-UART
- 降压模块
- 留两个2.54排针焊盘
- 充电&电池&电压检测模块
sheet 2
- 按键
- MCU
sheet 3
- 串口自动刷机模块
- MIC模块
- DAC&PA模块_MAX98357
sheet 4
- ASR接口
- 电位器接口
- 按键接口
- 扩展引脚
- 指示灯接口
- M3螺丝孔
